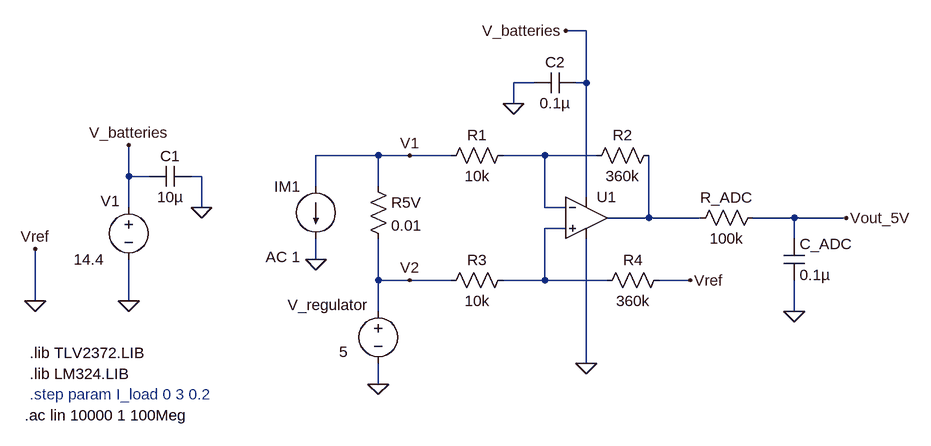
[diagram p0: schematic current_sense_interfaceSINGLElogic_optimised.asc]
current_sense_interfaceSINGLElogic_optimised.asc, the LTspice schematic file:
Version 4
SHEET 1 980 680
WIRE 464 -192 432 -192
WIRE 384 -112 352 -112
WIRE 464 -112 464 -192
WIRE 464 -112 448 -112
WIRE 352 -80 352 -112
WIRE 144 0 48 0
WIRE 192 0 144 0
WIRE 256 0 192 0
WIRE 400 0 336 0
WIRE 480 0 400 0
WIRE -240 32 -240 -16
WIRE -208 32 -240 32
WIRE -128 32 -144 32
WIRE 48 48 48 0
WIRE 144 48 144 0
WIRE 464 64 464 -112
WIRE -240 80 -240 32
WIRE -128 80 -128 32
WIRE 400 80 400 0
WIRE 432 80 400 80
WIRE 560 96 560 0
WIRE 560 96 496 96
WIRE 640 96 560 96
WIRE 784 96 720 96
WIRE 864 96 784 96
WIRE 432 112 400 112
WIRE 784 128 784 96
WIRE 48 160 48 128
WIRE 144 192 144 128
WIRE 192 192 144 192
WIRE 256 192 192 192
WIRE 400 192 400 112
WIRE 400 192 336 192
WIRE 496 192 400 192
WIRE 624 192 576 192
WIRE -384 224 -384 144
WIRE -240 224 -240 160
WIRE 144 240 144 192
WIRE 784 240 784 192
WIRE 464 320 464 128
WIRE 144 352 144 320
FLAG 48 160 0
FLAG 864 96 Vout_5V
FLAG 624 192 Vref
FLAG 192 192 V2
FLAG 192 0 V1
FLAG 432 -192 V_batteries
FLAG 464 320 0
FLAG -240 224 0
FLAG -384 144 Vref
FLAG -384 224 0
FLAG -240 -16 V_batteries
FLAG 144 352 0
FLAG 784 240 0
FLAG -128 80 0
FLAG 352 -80 0
SYMBOL res 576 -16 R90
WINDOW 0 0 56 VBottom 2
WINDOW 3 32 56 VTop 2
SYMATTR InstName R2
SYMATTR Value 360k
SYMATTR SpiceLine tol=1 pwr=0.6
SYMBOL res 592 176 R90
WINDOW 0 0 56 VBottom 2
WINDOW 3 32 56 VTop 2
SYMATTR InstName R4
SYMATTR Value 360k
SYMATTR SpiceLine tol=1 pwr=0.6
SYMBOL res 352 176 R90
WINDOW 0 0 56 VBottom 2
WINDOW 3 32 56 VTop 2
SYMATTR InstName R3
SYMATTR Value 10k
SYMATTR SpiceLine tol=1 pwr=0.6
SYMBOL res 352 -16 R90
WINDOW 0 0 56 VBottom 2
WINDOW 3 32 56 VTop 2
SYMATTR InstName R1
SYMATTR Value 10k
SYMATTR SpiceLine tol=1 pwr=0.6
SYMBOL res 128 32 R0
SYMATTR InstName R5V
SYMATTR Value 0.01
SYMATTR SpiceLine tol=1 pwr=1
SYMBOL current 48 48 M0
WINDOW 123 24 108 Left 2
WINDOW 39 0 0 Left 0
WINDOW 3 24 80 Invisible 2
SYMATTR Value2 AC 1
SYMATTR Value 0
SYMATTR InstName IM1
SYMBOL OpAmps\\opamp2 464 32 R0
WINDOW 3 16 96 Invisible 2
SYMATTR InstName U1
SYMATTR Value2 TLV2372
SYMBOL voltage -240 64 R0
WINDOW 0 -14 6 Right 2
WINDOW 3 -85 96 Left 2
WINDOW 123 0 0 Left 0
WINDOW 39 0 0 Left 0
SYMATTR InstName V1
SYMATTR Value 14.4
SYMBOL voltage 144 224 R0
WINDOW 0 -14 6 Right 2
WINDOW 3 -60 78 Left 2
WINDOW 123 0 0 Left 0
WINDOW 39 0 0 Left 0
SYMATTR InstName V_regulator
SYMATTR Value 5
SYMBOL res 736 80 R90
WINDOW 0 0 56 VBottom 2
WINDOW 3 32 56 VTop 2
SYMATTR InstName R_ADC
SYMATTR Value 100k
SYMBOL cap 768 128 R0
SYMATTR InstName C_ADC
SYMATTR Value 0.1µ
SYMBOL cap -144 16 R90
WINDOW 0 0 32 VBottom 2
WINDOW 3 32 32 VTop 2
SYMATTR InstName C1
SYMATTR Value 10µ
SYMBOL cap 448 -128 R90
WINDOW 0 0 32 VBottom 2
WINDOW 3 32 32 VTop 2
SYMATTR InstName C2
SYMATTR Value 0.1µ
TEXT -392 368 Left 2 ;.step param I_load 0 3 0.2
TEXT -392 304 Left 2 !.lib TLV2372.LIB
TEXT -392 336 Left 2 !.lib LM324.LIB
TEXT -400 400 Left 2 !.ac lin 10000 1 100Meg

The netlist it stands for:
* current_sense_interfaceSINGLElogic_optimised.asc
R2 N002 N001 360k tol=1 pwr=0.6
R4 0 N003 360k tol=1 pwr=0.6
R3 N003 V2 10k tol=1 pwr=0.6
R1 N001 V1 10k tol=1 pwr=0.6
R5V V1 V2 0.01 tol=1 pwr=1
IM1 V1 0 0 AC 1
XU1 N003 N001 V_batteries 0 N002 opamp2 TLV2372  ; pins In+ In- V+ V- OUT
V1 V_batteries 0 14.4
V_regulator V2 0 5
R_ADC Vout_5V N002 100k
C_ADC Vout_5V 0 0.1µ
C1 0 V_batteries 10µ
C2 V_batteries 0 0.1µ
* .step param I_load 0 3 0.2
.lib TLV2372.LIB
.lib LM324.LIB
.ac lin 10000 1 100Meg
.backanno
.end